# Altium project Twintig-USB.PrjPcb
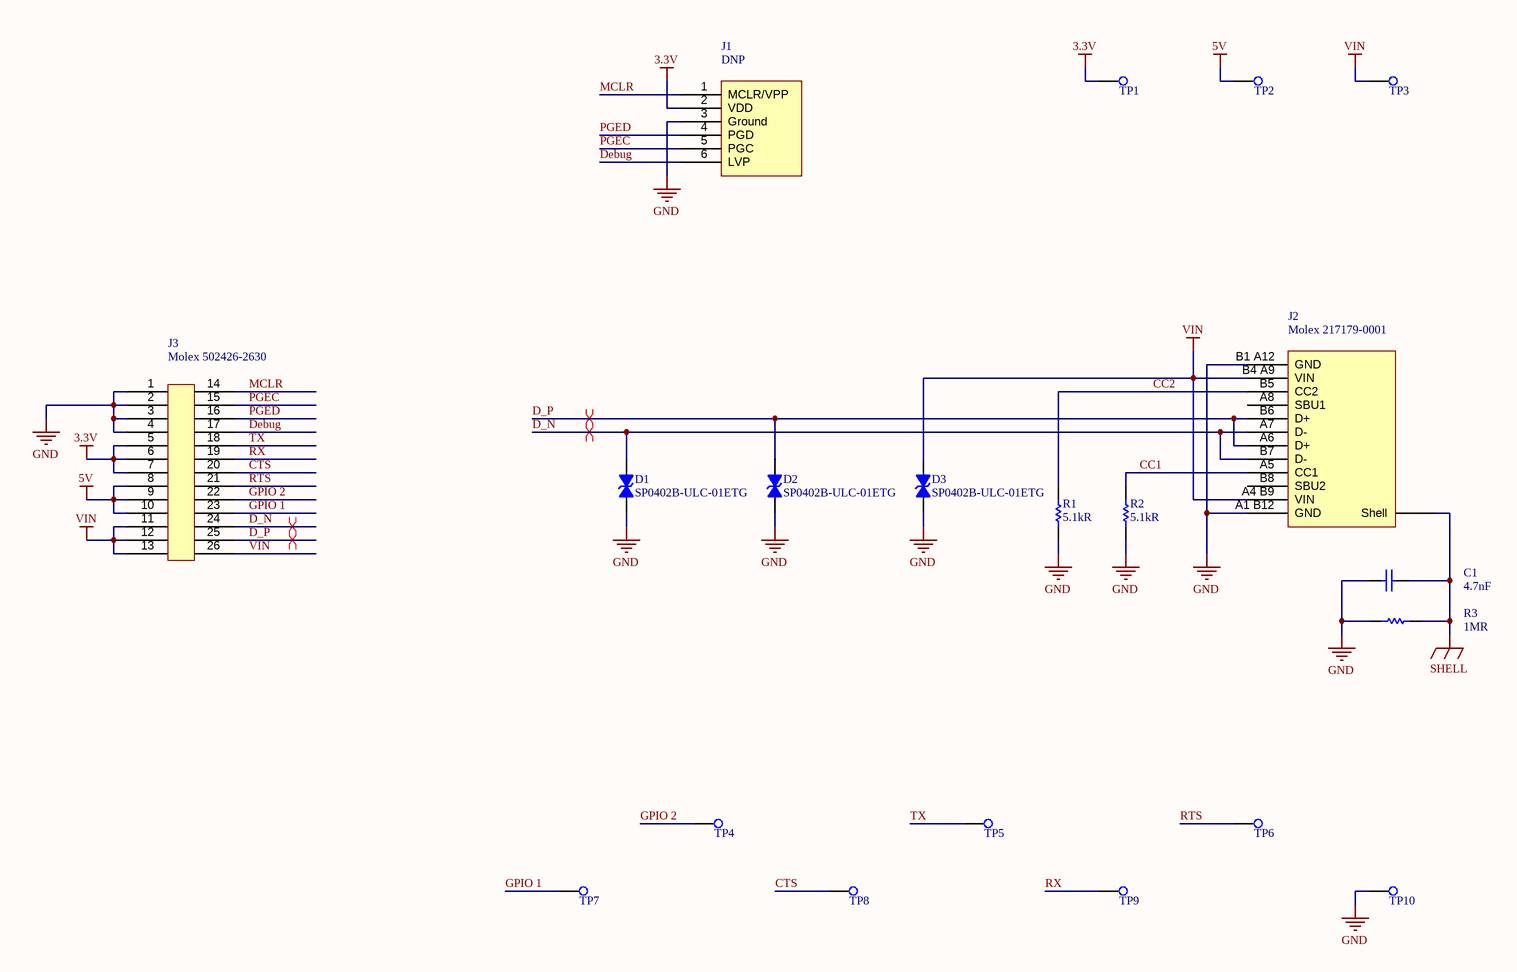
[diagram p0: Twintig-USB.SchDoc]
Author: Seb Madgwick; Project: Twintig USB; Version: v1.0.1
1 sheet, 20 parts. Net scope: global (net labels, ports and power ports of the same name join across sheets).
Board file: Twintig-USB.PcbDoc

## Sheet Twintig-USB.SchDoc
size A3; SheetNumber: 1; SheetTotal: 1

### Parts
C1  4.7nF  [Capacitor 0402]
D1  SP0402B-ULC-01ETG  [Diode TVS 0402]
D2  SP0402B-ULC-01ETG  [Diode TVS 0402]
D3  SP0402B-ULC-01ETG  [Diode TVS 0402]
J1  DNP  [Tag Connect No Legs]
J2  Molex 217179-0001  [Molex 217179-0001]
J3  Molex 502426-2630  [Molex 502426-2630]
R1  5.1kR  [Resistor 0402]
R2  5.1kR  [Resistor 0402]
R3  1MR  [Resistor 0402]
TP1  Test Point  [Test Point 1.5mm]  (value not drawn)
TP2  Test Point  [Test Point 1.5mm]  (value not drawn)
TP3  Test Point  [Test Point 1.5mm]  (value not drawn)
TP4  Test Point  [Test Point 1.5mm]  (value not drawn)
TP5  Test Point  [Test Point 1.5mm]  (value not drawn)
TP6  Test Point  [Test Point 1.5mm]  (value not drawn)
TP7  Test Point  [Test Point 1.5mm]  (value not drawn)
TP8  Test Point  [Test Point 1.5mm]  (value not drawn)
TP9  Test Point  [Test Point 1.5mm]  (value not drawn)
TP10  Test Point  [Test Point 1.5mm]  (value not drawn)

### Nets
3.3V: J1.2(VDD) J3.5 J3.6 J3.7 TP1.1
5V: J3.8 J3.9 J3.10 TP2.1
GND: C1.2 D1.2 D2.2 D3.2 J1.3(Ground) J2.A1_B12(GND) J2.B1_A12(GND) J3.1 J3.2 J3.3 J3.4 R1.1 R2.1 R3.2 TP10.1
SHELL: C1.1 J2.Shell R3.1
VIN: D3.1 J2.A4_B9(VIN) J2.B4_A9(VIN) J3.11 J3.12 J3.13 J3.26 TP3.1
CC1: J2.A5(CC1) R2.2
CC2: J2.B5(CC2) R1.2
CTS: J3.20 TP8.1
D_N: D1.1 J2.A7(D-) J2.B7(D-) J3.24
D_P: D2.1 J2.A6(D+) J2.B6(D+) J3.25
Debug: J1.6(LVP) J3.17
GPIO 1: J3.23 TP7.1
GPIO 2: J3.22 TP4.1
MCLR: J1.1(MCLR/VPP) J3.14
PGEC: J1.5(PGC) J3.15
PGED: J1.4(PGD) J3.16
RTS: J3.21 TP6.1
RX: J3.19 TP9.1
TX: J3.18 TP5.1

Not connected (* = marked no-connect by the designer): J2 A8(SBU1) B8(SBU2)

### Layout directives
differential pair: D_N, D_P

### Notes on the sheet
- TITLE
- SIZE
- A3
- VARIANT
- PROJECT
- SHEET
- VERSION
- OF
- AUTHOR
- DATE

### Library data of the parts
C1 = Capacitor
D1-D3 = Diode TVS
J1 = MPLAB ICSP
J2 = USB-C Receptacle (16 Pin)
R1-R3 = Resistor